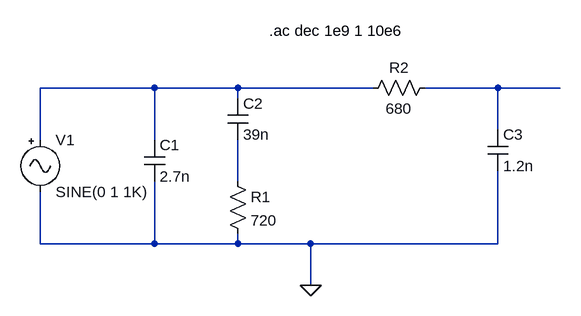
[diagram p0: schematic Loop Filter Simulation.asc]
Loop Filter Simulation.asc, the LTspice schematic file:
Version 4
SHEET 1 880 680
WIRE 48 240 -128 240
WIRE 176 240 48 240
WIRE 384 240 176 240
WIRE 576 240 464 240
WIRE 672 240 576 240
WIRE 176 256 176 240
WIRE 576 304 576 240
WIRE -128 320 -128 240
WIRE 48 320 48 240
WIRE 176 384 176 320
WIRE -128 480 -128 400
WIRE 48 480 48 384
WIRE 48 480 -128 480
WIRE 176 480 176 464
WIRE 176 480 48 480
WIRE 288 480 176 480
WIRE 576 480 576 368
WIRE 576 480 288 480
WIRE 288 544 288 480
FLAG 288 544 0
SYMBOL res 160 368 R0
SYMATTR InstName R1
SYMATTR Value 720
SYMBOL res 480 224 R90
WINDOW 0 0 56 VBottom 2
WINDOW 3 32 56 VTop 2
SYMATTR InstName R2
SYMATTR Value 680
SYMBOL cap 32 320 R0
SYMATTR InstName C1
SYMATTR Value 2.7n
SYMBOL cap 160 256 R0
SYMATTR InstName C2
SYMATTR Value 39n
SYMBOL cap 560 304 R0
SYMATTR InstName C3
SYMATTR Value 1.2n
SYMBOL Misc/signal -128 304 R0
SYMATTR InstName V1
SYMATTR Value2 AC 1
TEXT 224 152 Left 2 !.ac dec 1e9 1 10e6

The netlist it stands for:
* Loop Filter Simulation.asc
R1 N003 0 720
R2 N002 N001 680
C1 N001 0 2.7n
C2 N001 N003 39n
C3 N002 0 1.2n
V1 N001 0 SINE(0 1 1K) AC 1
.ac dec 1e9 1 10e6
.backanno
.end